# EAGLE design tester (EAGLE 5.06)
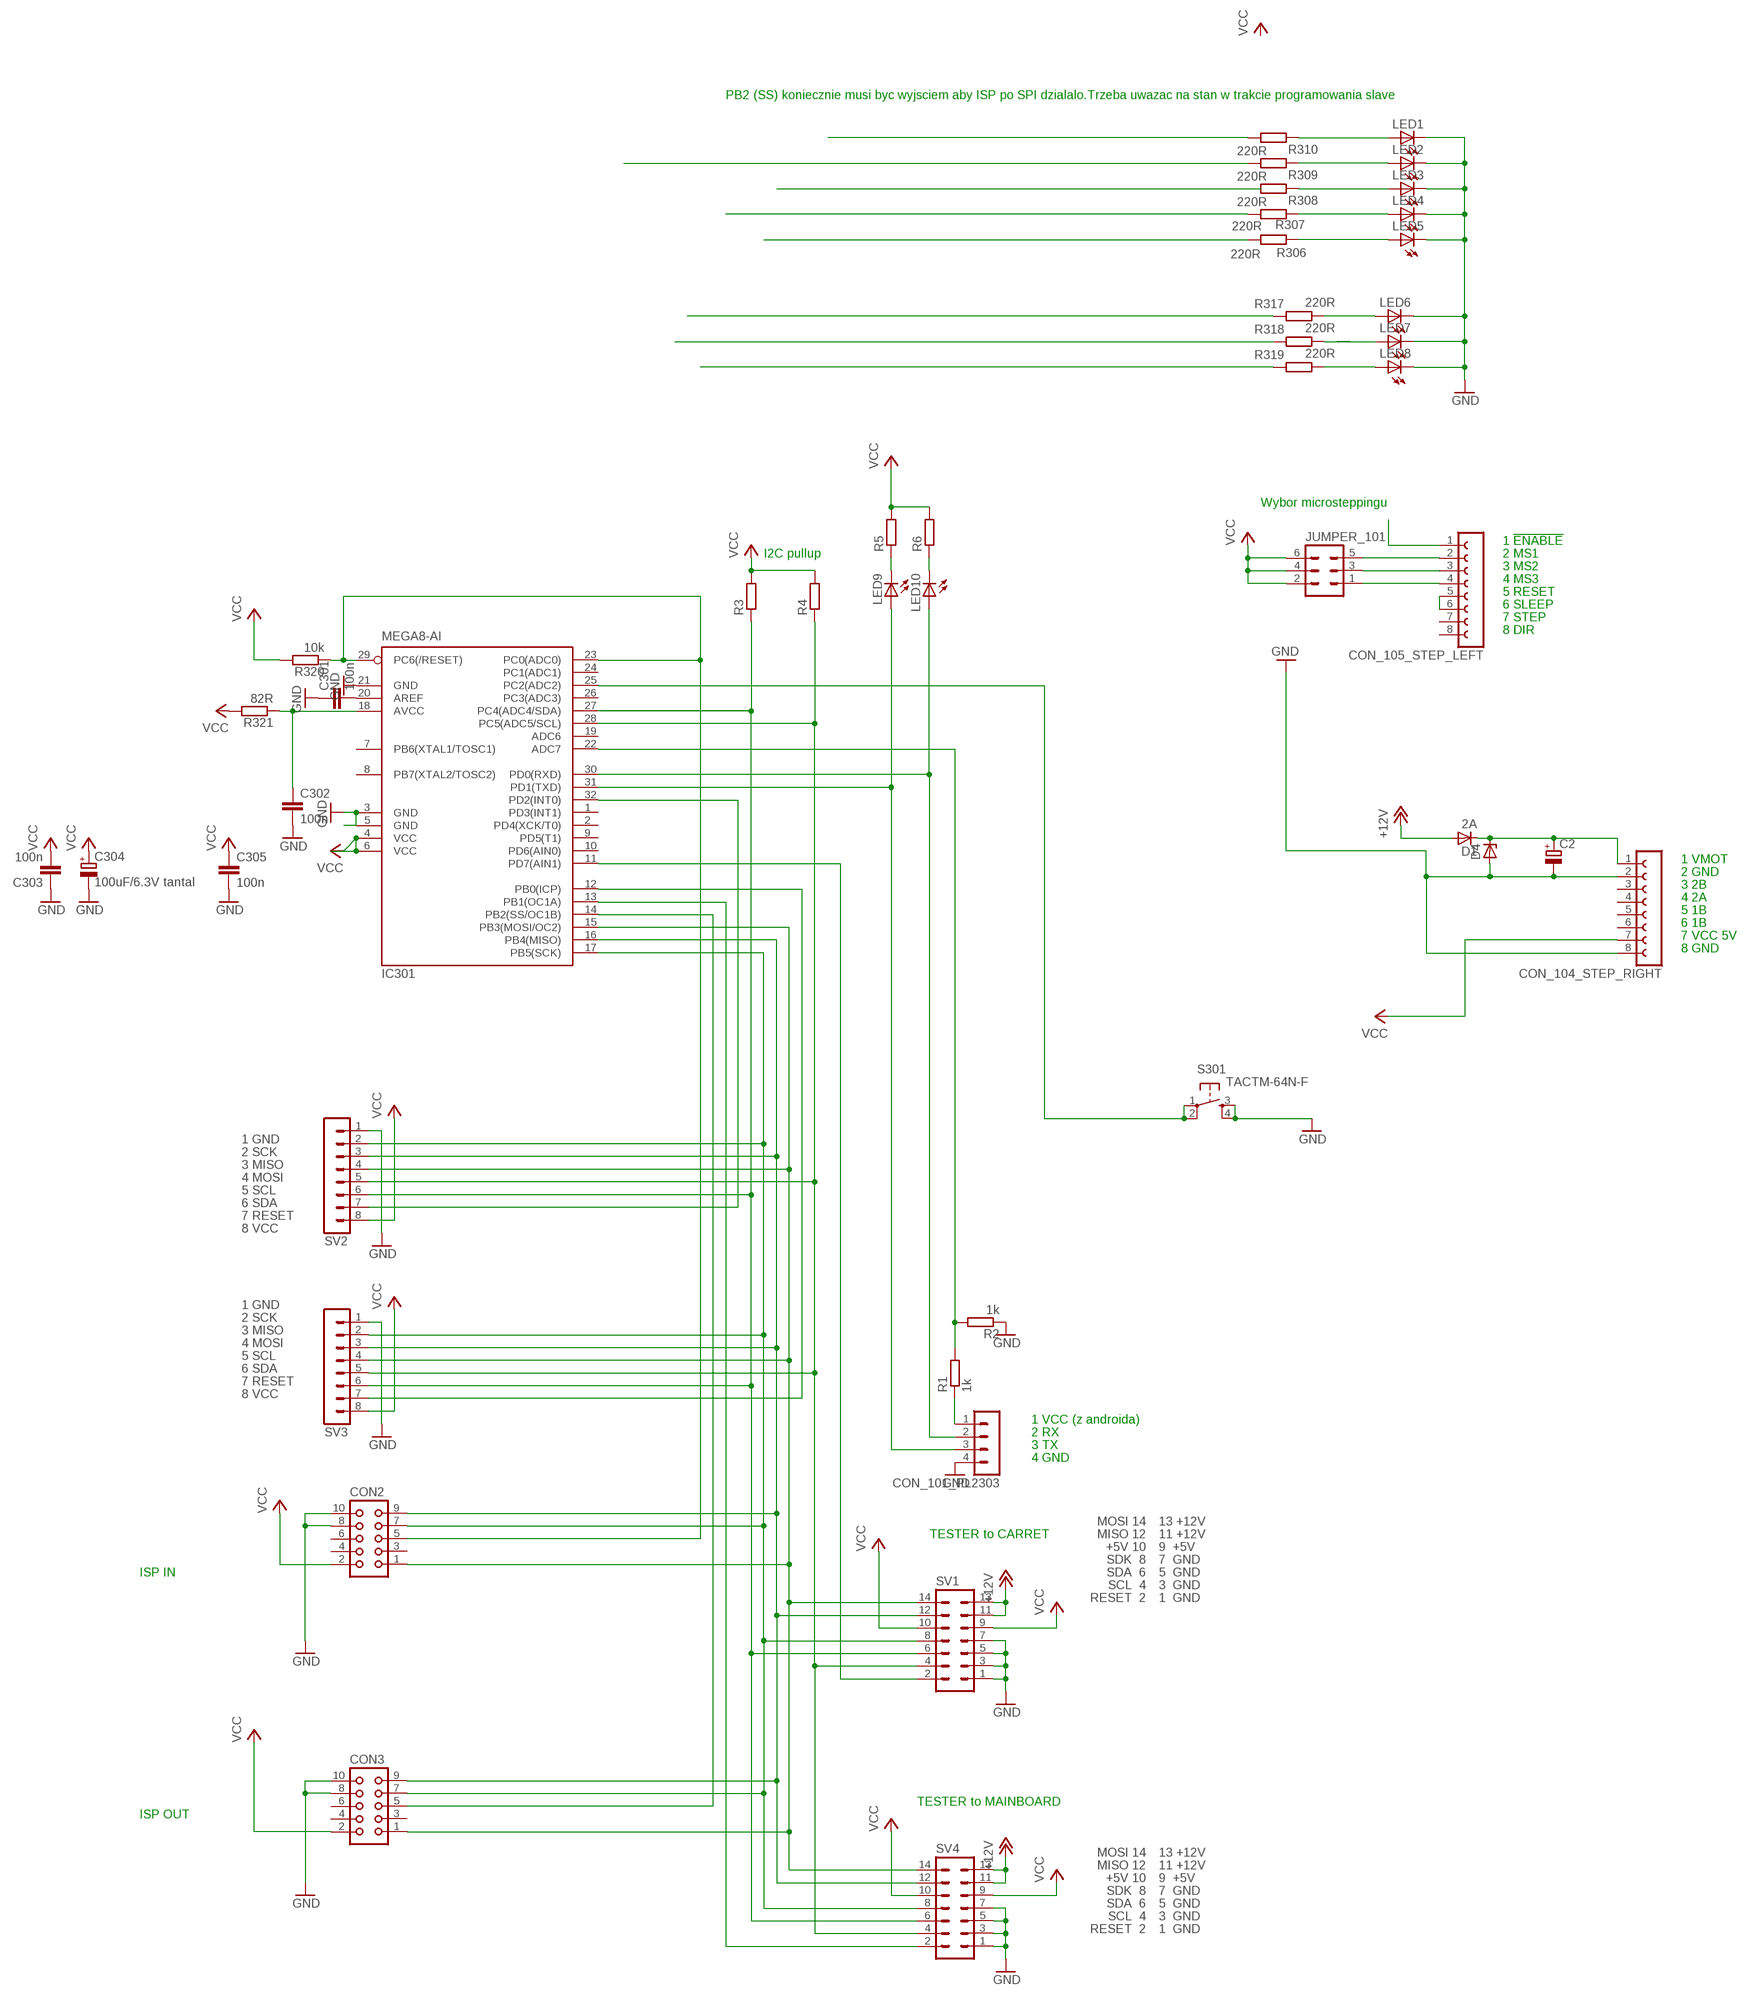
[diagram p0: schematic, sheet 1]

## Parts
C2  CPOL-EUE5-10.5  [E5-10,5]
C301  100n  CAP  [0805]
C302  100n  CAP  [0805]
C303  100n  CAP  [0805]
C304  100uF/6.3V tantal  CPOL-EUSMCB  [SMC_B]
C305  100n  CAP  [0805]
CON2  CON10  [CON10]
CON3  CON10  [CON10]
CON_101_PL2303  MA04-1  [MA04-1]
CON_104_STEP_RIGHT  FE08-1  [FE08]
CON_105_STEP_LEFT  FE08-1  [FE08]
D1  2A  BYS10  [SOD106A]
D4  ZENER-DIODESOD80C  [SOD80C]
IC301  MEGA8-AI  [TQFP32-08]
JUMPER_101  MA03-2  [MA03-2]
LED1  LEDSQR2X5  [LED2X5]
LED2  LEDSQR2X5  [LED2X5]
LED3  LEDSQR2X5  [LED2X5]
LED4  LEDSQR2X5  [LED2X5]
LED5  LEDSQR2X5  [LED2X5]
LED6  LEDSQR2X5  [LED2X5]
LED7  LEDSQR2X5  [LED2X5]
LED8  LEDSQR2X5  [LED2X5]
LED9  LEDSQR2X5  [LED2X5]
LED10  LEDSQR2X5  [LED2X5]
R1  1k  RES0805  [0805]
R2  1k  RES0805  [0805]
R3  RES0805  [0805]
R4  RES0805  [0805]
R5  RES0805  [0805]
R6  RES0805  [0805]
R306  220R  RES0805  [0805]
R307  220R  RES0805  [0805]
R308  220R  RES0805  [0805]
R309  220R  RES0805  [0805]
R310  220R  RES0805  [0805]
R317  220R  R-EU_R0805  [R0805]
R318  220R  R-EU_R0805  [R0805]
R319  220R  R-EU_R0805  [R0805]
R320  10k  RES0805  [0805]
R321  82R  RES0805  [0805]
S301  TACTM-64N-F  DTSM-6  [DTSM-6]
SV1  ML14  [ML14]
SV2  MA08-1  [MA08-1]
SV3  MA08-1  [MA08-1]
SV4  ML14  [ML14]

## Nets
+12V: D1.A SV1.11 SV1.13 SV4.11 SV4.13
CARRET_RESET: SV1.2
GND: C2.- C301.1 C302.2 C303.1 C304.- C305.2 CON2.8 CON2.10 CON3.8 CON3.10 CON_101_PL2303.4 CON_104_STEP_RIGHT.2 CON_104_STEP_RIGHT.8 D4.A IC301.3(GND) IC301.5(GND) IC301.21(GND) LED1.K(C) LED2.K(C) LED3.K(C) LED4.K(C) LED5.K(C) LED6.K(C) LED7.K(C) LED8.K(C) R2.1 S301.3 S301.4 SV1.1 SV1.3 SV1.5 SV1.7 SV2.1 SV3.1 SV4.1 SV4.3 SV4.5 SV4.7
MISO1: CON2.9 CON3.9 IC301.16(PB4(MISO)) SV1.12 SV2.3 SV3.3 SV4.12
MOSI2: CON2.1 CON3.1 IC301.15(PB3(MOSI/OC2)) SV1.14 SV2.4 SV3.4 SV4.14
N$1: LED5.A R306.1
N$2: LED3.A R308.1
N$3: CON_101_PL2303.2 IC301.30(PD0(RXD)) LED10.A
N$4: LED1.A R310.1
N$5: CON_101_PL2303.3 IC301.31(PD1(TXD)) LED9.A
N$6: LED8.A R319.2
N$7: LED7.A R318.2
N$8: LED6.A R317.2
N$9: R317.1
N$10: CON_105_STEP_LEFT.1
N$12: R309.2
N$14: R307.2
N$15: LED4.A R307.1
N$16: LED2.A R309.1
N$17: R319.1
N$18: R306.2
N$19: IC301.25(PC2(ADC2)) S301.1 S301.2
N$20: R318.1
N$21: R310.2
N$22: IC301.11(PD7(AIN1))
N$23: LED9.K(C) R5.1
N$24: IC301.13(PB1(OC1A)) SV4.2
N$26: LED10.K(C) R6.1
N$27: CON3.5 IC301.14(PB2(SS/OC1B))
N$32: C301.2 IC301.20(AREF)
N$33: C302.1 IC301.18(AVCC) R321.1
N$44: CON_105_STEP_LEFT.5 CON_105_STEP_LEFT.6
N$47: IC301.12(PB0(ICP)) SV3.7
N$48: IC301.22(ADC7) R1.2 R2.2
N$49: IC301.32(PD2(INT0)) SV2.7
N$50: CON_105_STEP_LEFT.2 JUMPER_101.5
N$51: CON_105_STEP_LEFT.3 JUMPER_101.3
N$52: CON_105_STEP_LEFT.4 JUMPER_101.1
N$54: CON2.5 IC301.23(PC0(ADC0)) IC301.29(PC6(/RESET)) R320.1
N$55: CON_101_PL2303.1 R1.1
N$56: C2.+ CON_104_STEP_RIGHT.1 D1.K D4.C
SCK1: CON2.7 CON3.7 IC301.17(PB5(SCK)) SV1.8 SV2.2 SV3.2 SV4.8
SCL1: IC301.28(PC5(ADC5/SCL)) R4.1 SV1.4 SV2.5 SV3.5 SV4.4
SDA1: IC301.27(PC4(ADC4/SDA)) R3.1 SV1.6 SV2.6 SV3.6 SV4.6
VCC: C303.2 C304.+ C305.1 CON2.2 CON3.2 CON_104_STEP_RIGHT.7 IC301.4(VCC) IC301.6(VCC) JUMPER_101.2 JUMPER_101.4 JUMPER_101.6 R3.2 R4.2 R5.2 R6.2 R320.2 R321.2 SV1.9 SV1.10 SV2.8 SV3.8 SV4.9 SV4.10
Unconnected: CON2.3 CON2.4 CON2.6 CON3.3 CON3.4 CON3.6 CON_104_STEP_RIGHT.3 CON_104_STEP_RIGHT.4 CON_104_STEP_RIGHT.5 CON_104_STEP_RIGHT.6 CON_105_STEP_LEFT.7 CON_105_STEP_LEFT.8 IC301.1(PD3(INT1)) IC301.2(PD4(XCK/T0)) IC301.7(PB6(XTAL1/TOSC1)) IC301.8(PB7(XTAL2/TOSC2)) IC301.9(PD5(T1)) IC301.10(PD6(AIN0)) IC301.19(ADC6) IC301.24(PC1(ADC1)) IC301.26(PC3(ADC3)) R308.2

## Notes on the sheet
- PB2 (SS) koniecznie musi byc wyjsciem aby ISP po SPI dzialalo.Trzeba uwazac na stan w trakcie programowania slave
- Wybor microsteppingu
- 1 !ENABLE
- I2C pullup | 2 MS1
- 3 MS2
- 4 MS3
- 5 RESET
- 6 SLEEP
- 7 STEP
- 8 DIR
- 1 VMOT
- 2 GND
- 3 2B
- 4 2A
- 5 1B
- 6 1B
- 7 VCC 5V
- 8 GND
- 1 GND
- 2 SCK
- 3 MISO
- 4 MOSI
- 5 SCL
- 6 SDA
- 7 RESET
- 8 VCC
- 1 GND
- 2 SCK
- 3 MISO
- 4 MOSI
- 5 SCL
- 6 SDA
- 7 RESET
- 8 VCC
- 1 VCC (z androida)
- 2 RX
- 3 TX
- 4 GND
- MOSI 14 | 13 +12V
- TESTER to CARRET | MISO 12 | 11 +12V
- +5V 10 | 9  +5V
- SDK  8 | 7  GND
- ISP IN | SDA  6 | 5  GND
- SCL  4 | 3  GND
- RESET  2 | 1  GND
- TESTER to MAINBOARD
- ISP OUT
- MOSI 14 | 13 +12V
- MISO 12 | 11 +12V
- +5V 10 | 9  +5V
- SDK  8 | 7  GND
- SDA  6 | 5  GND
- SCL  4 | 3  GND
- RESET  2 | 1  GND

## Library data of the parts
C2 C304 = rcl:CPOL-EU: POLARIZED CAPACITOR, European symbol
C301-C303 C305 = barobot:CAP
CON2 CON3 = con-harting:CON10: CONNECTOR
CON_101_PL2303 = con-lstb:MA04-1: PIN HEADER
CON_104_STEP_RIGHT CON_105_STEP_LEFT = con-lsta:FE08-1: FEMALE HEADER
D1 = telefunken:BYS10: DIODE
D4 = diode:ZENER-DIODE: Z-Diode
IC301 = atmel:MEGA8: MICROCONTROLLER 8 Kbytes FLASH, 1 kbytes SRAM, 512 bytes EEPROM, USART, 6-channel 10 bit ADC, 2-channel 8 bit ADC Pin compatible with Atmega48, ATMega88, ATMega168 Source: avr.lbr
JUMPER_101 = con-lstb:MA03-2: PIN HEADER
LED1-LED10 = led:LED: LED OSRAM: - CHIPLED LG R971, LG N971, LY N971, LG Q971, LY Q971, LO R971, LY R971 LH N974, LH R974 LS Q976, LO Q976, LY Q976 LO Q996 - Hyper CHIPLED LW Q18S LB Q993, LB Q99A, LB R99A - SideLED LS A670, LO A670, LY A670, LG A670, LP A670 LB A673, LV A673, LT A673, LW A673 LH A674 LY A675 LS A676, LA A676, LO A676, LY A676, LW A676 LS A679, LY A679, LG A679 - Hyper Micro SIDELED® LS Y876, LA Y876, LO Y876, LY Y876 LT Y87S - SmartLED LW L88C, LW L88S LB L89C, LB L89S, LG L890 LS L89K, LO L89K, LY L89K LS L896, LA L896, LO L896, LY L896 - TOPLED LS T670, LO T670, LY T670, LG T670, LP T670 LSG T670, LSP T670, LSY T670, LOP T670, LYG T670 LG T671, LOG T671, LSG T671 LB T673, LV T673, LT T673, LW T673 LH T674 LS T676, LA T676, LO T676, LY T676, LB T676, LH T676, LSB T676, LW T676 LB T67C, LV T67C, LT T67C, LS T67K, LO T67K, LY T67K, LW E67C LS E67B, LA E67B, LO E67B, LY E67B, LB E67C, LV E67C, LT E67C LW T67C LS T679, LY T679, LG T679 LS T770, LO T770, LY T770, LG T770, LP T770 LB T773, LV T773, LT T773, LW T773 LH T774 LS E675, LA E675, LY E675, LS T675 LS T776, LA T776, LO T776, LY T776, LB T776 LHGB T686 LT T68C, LB T68C - Hyper Mini TOPLED® LB M676 - Mini TOPLED Santana® LG M470 LS M47K, LO M47K, LY M47K Source: http://www.osram.convergy.de LUXEON: - LUMILED® LXK2-PW12-R00, LXK2-PW12-S00, LXK2-PW14-U00, LXK2-PW14-V00 LXK2-PM12-R00, LXK2-PM12-S00, LXK2-PM14-U00 LXK2-PE12-Q00, LXK2-PE12-R00, LXK2-PE12-S00, LXK2-PE14-T00, LXK2-PE14-U00 LXK2-PB12-K00, LXK2-PB12-L00, LXK2-PB12-M00, LXK2-PB14-N00, LXK2-PB14-P00, LXK2-PB14-Q00 LXK2-PR12-L00, LXK2-PR12-M00, LXK2-PR14-Q00, LXK2-PR14-R00 LXK2-PD12-Q00, LXK2-PD12-R00, LXK2-PD12-S00 LXK2-PH12-R00, LXK2-PH12-S00 LXK2-PL12-P00, LXK2-PL12-Q00, LXK2-PL12-R00 Source: www.luxeon.com KINGBRIGHT: KA-3528ASYC Source: www.kingbright.com
R1-R6 R306-R310 R320 R321 = barobot:RES
R317-R319 = resistor:R-EU_: RESISTOR, European symbol
S301 = switch-tact:DTSM-6
SV1 SV4 = con-ml:ML14: HARTING
SV2 SV3 = con-lstb:MA08-1: PIN HEADER

## Board
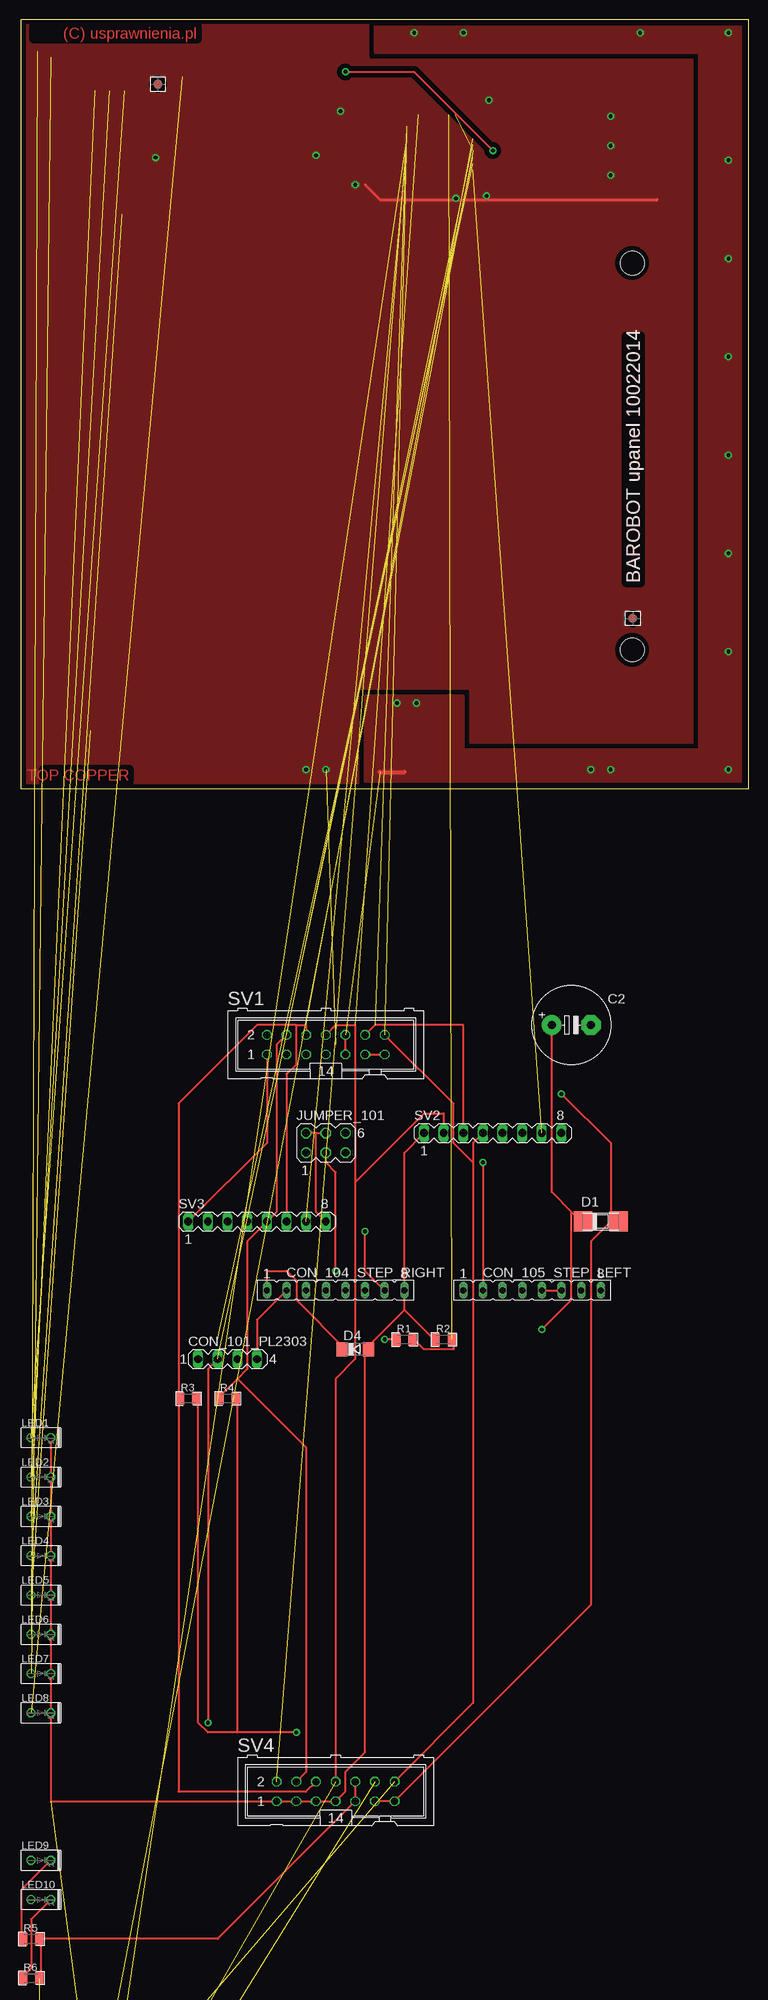
[diagram p1: board, top side]
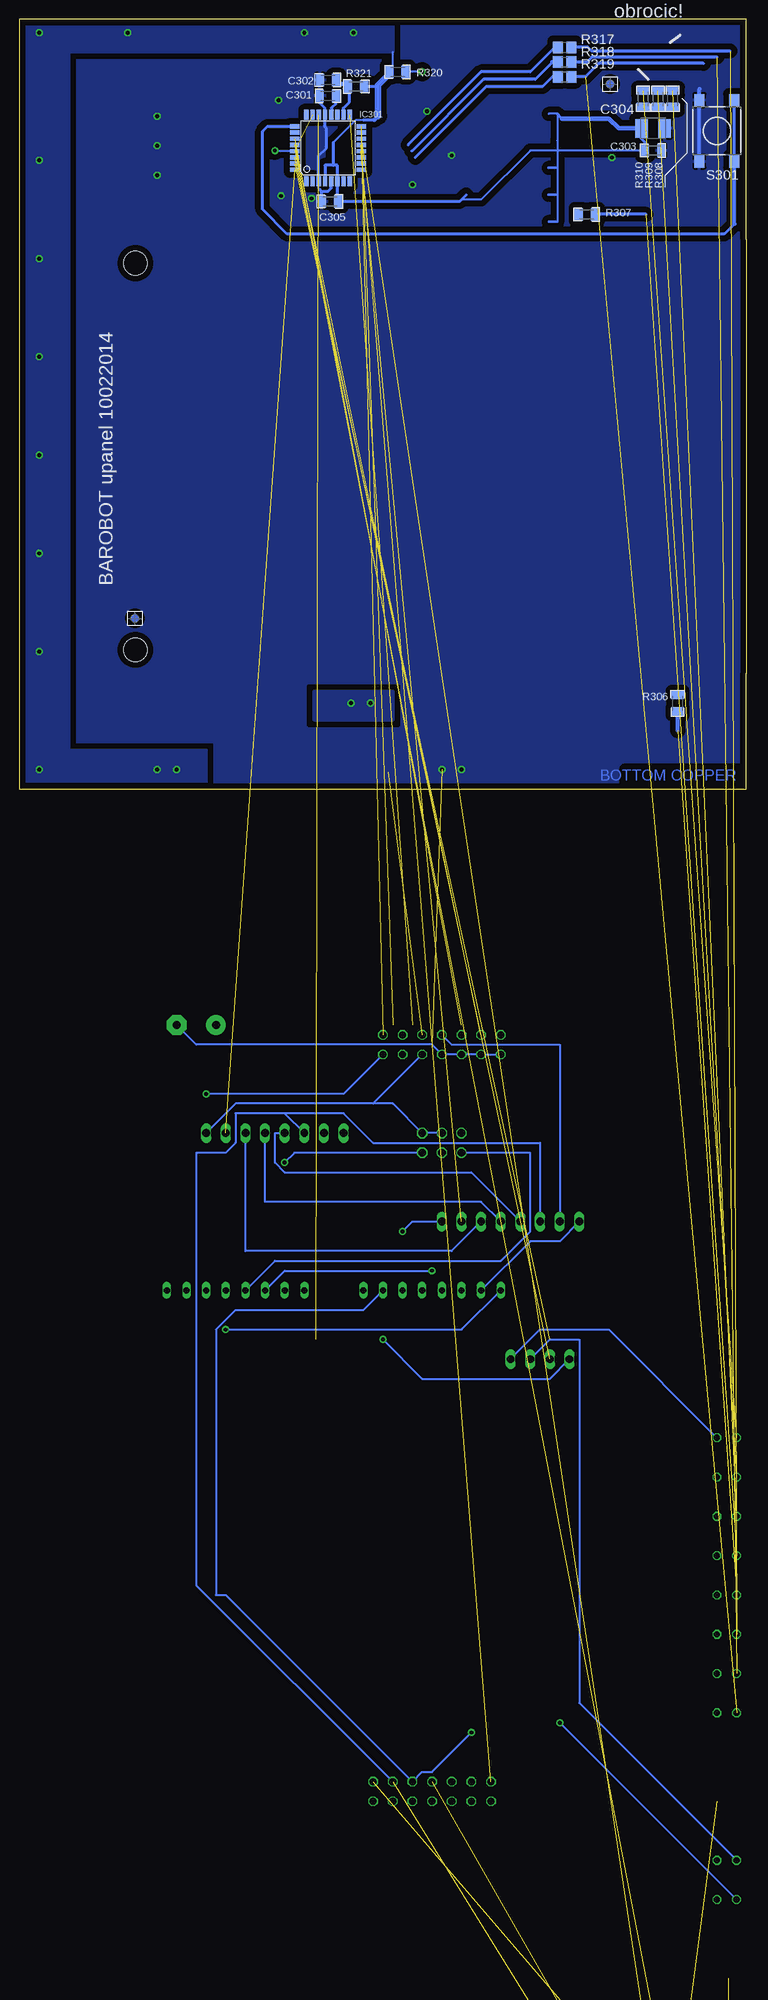
[diagram p2: board, bottom side, seen from below]

Size 94.03 x 99.5 mm. Coordinates in mm from the lower left corner, seen from the top.
Outline: 0.03,99.5 94.03,99.5 94.03,0 0.03,0 0.03,15 0,15 0,71 0.03,71 0.03,99.5
Copper layers (1*16): Top 0.035mm / dielectric 1.5mm / Bottom 0.035mm
Design rules "default *": minimum track width 10mil, minimum drill 0.5mm, track to track 10mil, track to pad 10mil, pad to pad 8mil, via to via 8mil, smd to smd 8mil, copper to edge 20mil, drill to drill 8mil, minimum pad ring 6mil, minimum via ring 8mil, stop-mask expansion 2mil, vias tented up to drill 0mil, thermal gap 10mil
Holes 3.1 mm at 79.03,18 79.03,68
bRestrict: area 11.8,84.1 to 12.4,87

### Footprints (pad centres in the part's own frame; a part is rotated, then mirrored left to right if it is on the bottom)
E5-10,5 = drill 1.016 pad 2.54 round: + -2.54,0 | drill 1.016 pad 2.54 octagon: - 2.54,0
0805 = smd 1.044 x 1.6: 1 -1.048,0; 2 1.048,0
SMC_B = smd 1.6 x 2.4: + -1.5,0; - 1.5,0
CON10 = drill 0.914 round: 1 -5.08,-1.27 | drill 0.914 octagon: 2 -5.08,1.27; 3 -2.54,-1.27; 4 -2.54,1.27; 5 0,-1.27; 6 0,1.27; 7 2.54,-1.27; 8 2.54,1.27; 9 5.08,-1.27; 10 5.08,1.27
MA04-1 = drill 1.016 long: 1 -3.81,0; 2 -1.27,0; 3 1.27,0; 4 3.81,0
FE08 = drill 0.813 long: 1 -8.89,0; 2 -6.35,0; 3 -3.81,0; 4 -1.27,0; 5 1.27,0; 6 3.81,0; 7 6.35,0; 8 8.89,0
SOD106A = smd 2.4 x 2.6: A 2.3,0; K -2.3,0
SOD80C = smd 1.4 x 1.8: A 1.7,0; C -1.7,0
TQFP32-08 = smd 1.27 x 0.559: 1 -4.293,2.8; 2 -4.293,2; 3 -4.293,1.2; 4 -4.293,0.4; 5 -4.293,-0.4; 6 -4.293,-1.2; 7 -4.293,-2; 8 -4.293,-2.8; 17 4.293,-2.8; 18 4.293,-2; 19 4.293,-1.2; 20 4.293,-0.4; 21 4.293,0.4; 22 4.293,1.2; 23 4.293,2; 24 4.293,2.8 | smd 0.559 x 1.27: 9 -2.8,-4.293; 10 -2,-4.293; 11 -1.2,-4.293; 12 -0.4,-4.293; 13 0.4,-4.293; 14 1.2,-4.293; 15 2,-4.293; 16 2.8,-4.293; 25 2.8,4.293; 26 2,4.293; 27 1.2,4.293; 28 0.4,4.293; 29 -0.4,4.293; 30 -1.2,4.293; 31 -2,4.293; 32 -2.8,4.293
MA03-2 = drill 1.016 round: 1 -2.54,-1.27 | drill 1.016 octagon: 2 -2.54,1.27; 3 0,-1.27; 4 0,1.27; 5 2.54,-1.27; 6 2.54,1.27
LED2X5 = drill 0.813 octagon: A -1.27,0; K 1.27,0
R0805 = smd 1.3 x 1.5: 1 -0.85,0; 2 0.85,0
DTSM-6 = smd 1.55 x 1.3: 1 -3.975,2.25; 2 3.975,2.25; 3 -3.975,-2.25; 4 3.975,-2.25
ML14 = drill 0.914 octagon: 1 -7.62,-1.27; 2 -7.62,1.27; 3 -5.08,-1.27; 4 -5.08,1.27; 5 -2.54,-1.27; 6 -2.54,1.27; 7 0,-1.27; 8 0,1.27; 9 2.54,-1.27; 10 2.54,1.27; 11 5.08,-1.27; 12 5.08,1.27; 13 7.62,-1.27; 14 7.62,1.27
MA08-1 = drill 1.016 long: 1 -8.89,0; 2 -6.35,0; 3 -3.81,0; 4 -1.27,0; 5 1.27,0; 6 3.81,0; 7 6.35,0; 8 8.89,0

### Placement (x,y rotation side)
C2  71.15,-30.48 0 top  (outside the outline)
C301  54.14,89.6 0 bottom
C302  54.11,91.66 180 bottom
C303  12.09,82.55 180 bottom
C304  12.09,85.41 0 bottom
C305  53.85,75.95 180 bottom
CON2  7.65,-180.34 0 top  (outside the outline)
CON3  7.65,-195.58 0 top  (outside the outline)
CON_101_PL2303  26.7,-73.66 0 top  (outside the outline)
CON_104_STEP_RIGHT  40.67,-64.77 0 top  (outside the outline)
CON_105_STEP_LEFT  66.07,-64.77 0 top  (outside the outline)
D1  74.96,-55.88 0 top  (outside the outline)
D4  43.21,-72.39 0 top  (outside the outline)
IC301  54.11,82.87 90 bottom
JUMPER_101  39.4,-45.72 0 top  (outside the outline)
LED1  2.57,-83.82 0 top  (outside the outline)
LED2  2.57,-88.9 0 top  (outside the outline)
LED3  2.57,-93.98 0 top  (outside the outline)
LED4  2.57,-99.06 0 top  (outside the outline)
LED5  2.57,-104.14 0 top  (outside the outline)
LED6  2.57,-109.22 0 top  (outside the outline)
LED7  2.57,-114.3 0 top  (outside the outline)
LED8  2.57,-119.38 0 top  (outside the outline)
LED9  2.57,-138.43 0 top  (outside the outline)
LED10  2.57,-143.51 0 top  (outside the outline)
R1  49.56,-71.12 0 top  (outside the outline)
R2  54.64,-71.12 0 top  (outside the outline)
R3  21.62,-78.74 0 top  (outside the outline)
R4  26.7,-78.74 0 top  (outside the outline)
R5  1.3,-148.59 0 top  (outside the outline)
R6  1.3,-153.67 0 top  (outside the outline)
R306  8.92,11.11 90 bottom
R307  20.67,74.3 180 bottom
R308  9.55,89.22 270 bottom
R309  11.46,89.22 270 bottom
R310  13.36,89.22 270 bottom
R317  23.52,95.89 0 bottom
R318  23.52,93.98 0 bottom
R319  23.52,92.08 0 bottom
R320  45.11,92.71 180 bottom
R321  50.51,90.81 0 bottom
S301  3.84,85.09 270 bottom
SV1  39.4,-33.02 0 top  (outside the outline)
SV2  60.99,-44.45 0 top  (outside the outline)
SV3  30.51,-55.88 0 top  (outside the outline)
SV4  40.67,-129.54 0 top  (outside the outline)
U$1  [FIDUCIAL_G10S]  17.69,91.11 0 top
U$2  [FIDUCIAL_G10S]  17.65,91.12 0 bottom
U$3  [FIDUCIAL_G10S]  79.09,22.07 0 bottom
U$4  [FIDUCIAL_G10S]  79.09,22.07 0 top

### Tracks (layer width: path | path; a pad name or v marks a point on that pad's centre or on a via)
+12V  (via drill 0.5)
  Top 0.254: SV1.11 SV1.13 | SV4.11 SV4.13 73.69,-105.41 73.69,-58.42 76.23,-55.88 | v69.88,-39.37 76.23,-45.72 76.23,-55.88 | 76.23,-55.88 D1.A
  Bottom 0.254: SV1.13 52.1,-39.37 v69.88,-39.37
GND  (via drill 0.5)  (5 unrouted)
  Top 0.254: CON_104_STEP_RIGHT.2 30.51,-68.58 CON_101_PL2303.4 | SV3.1 31.78,-45.72 SV1.1 | 49.56,-67.31 53.37,-71.12 R2.1 | 49.56,-67.31 CON_104_STEP_RIGHT.8 49.56,-46.99 SV2.1 | 44.48,-72.39 49.56,-67.31 | LED1.K LED2.K LED3.K LED4.K LED5.K LED6.K LED7.K LED8.K 3.84,-130.81 SV4.1 SV4.3 SV4.5 SV4.7 41.94,-129.54 41.94,-127 44.48,-124.46 44.48,-72.39 | 44.48,-72.39 D4.A
  Top 0.406: 82.26,76.2 46.38,76.2 44.48,78.11
  Bottom 0.254: IC301.3 55.31,77.6 55.24,77.52 | SV1.1 SV1.3 SV1.5 SV1.7 40.67,-33.02 71.15,-33.02 C2.- | CON_104_STEP_RIGHT.2 27.97,-58.42 24.16,-58.42 SV3.1 | CON_101_PL2303.4 26.7,-69.85 17.81,-69.85 LED1.K
  Bottom 0.406: IC301.5 53.71,77.69 54.11,77.29 54.96,77.29 | 54.96,77.29 55.01,77.29 55.24,77.52 | 55.24,89.48 55.24,88.74 54.51,88.02 IC301.21 54.51,85.6 54.32,85.41 54.32,82.87 55.31,81.88 IC301.3 | C305.2 54.96,76.01 54.96,77.29
  Bottom 0.508: S301.4 S301.3 6.09,90.49 | C302.2 55.15,91.67 55.13,91.68 55.11,91.68 55.14,91.66 55.14,91.64 55.04,91.74 55.03,91.74
  other vias: 38.13,81.92 56.23,76.36 43.21,78.11 76.23,79.38 76.23,83.19 76.23,87 60.51,89.06 41.3,87.63 60.2,76.68 39.4,2.54 36.86,2.54 17.41,81.64
  pour Bottom (isolate 0.762, rank 3): -1.24,101.6 99.09,101.6 99.09,-2.54 -1.24,-2.54
  pour Top (isolate 0.61, rank 2): 0.03,99.06 96.55,99.06 96.55,-1.27 0.03,-1.27
MISO1  (3 unrouted)
  Top 0.254: SV1.12 45.75,-30.48 57.18,-30.48 SV2.3
  Bottom 0.254: SV4.12 71.15,-102.87 71.15,-46.99 67.34,-46.99 66.07,-45.72 66.07,-41.91 59.72,-41.91 | 59.72,-41.91 SV2.3 | SV3.3 26.7,-45.72 48.29,-45.72 52.1,-41.91 59.72,-41.91
MOSI2  (3 unrouted)
  Top 0.254: SV4.14 58.45,-118.11 58.45,-48.26 | 58.45,-48.26 58.45,-45.72 SV2.4 | SV1.14 55.91,-40.64 55.91,-45.72 58.45,-48.26
  Bottom 0.254: SV3.4 35.59,-49.53 59.72,-49.53 60.99,-48.26 60.99,-44.45 SV2.4
N$1  (1 unrouted)
  Bottom 0.508: 8.92,7.61 R306.1
N$2  (1 unrouted)
  Bottom 0.406: R308.1 9.73,90.27
N$3  (via drill 0.5)  (1 unrouted)
  Top 0.254: v24.16,-120.65 24.16,-74.93 CON_101_PL2303.2
  Bottom 0.254: v24.16,-120.65 LED10.A
N$4  (1 unrouted)
  Bottom 0.406: R310.1 13.19,90.27
N$5  (1 unrouted)
  Bottom 0.254: LED9.A 21.62,-118.11 21.62,-71.12 25.43,-71.12 CON_101_PL2303.3
N$6  (1 unrouted)
  Bottom 0.406: 5.57,93.82 19.08,93.82 20.83,92.08 R319.2
N$7  (1 unrouted)
  Bottom 0.406: 3.84,94.62 20.03,94.62 20.67,93.98 R318.2
N$8  (1 unrouted)
  Bottom 0.406: 2.11,95.41 20.03,95.41 20.51,95.89 R317.2
N$9
  Bottom 0.406: 43.76,83.27 34.32,92.71 27.97,92.71 24.79,95.89 R317.1
N$15  (1 unrouted)
  Bottom 0.406: 13.01,74.3 R307.1
N$16  (1 unrouted)
N$17
  Bottom 0.406: R319.1 25.11,92.08 26.38,90.81 33.68,90.81 42.82,81.67
N$19
  Bottom 0.406: 1.59,73.05 2.89,71.76 59.4,71.76 62.58,74.93 62.58,85.03 61.94,85.67 IC301.25 | S301.2 S301.1
  Bottom 0.508: 1.59,73.05 S301.2
N$20
  Bottom 0.406: 25.11,93.98 27.33,91.76 34,91.76 43.29,82.47
  Bottom 0.508: R318.1 25.11,93.98
N$23
  Top 0.254: LED9.K 0.03,-142.24 0.03,-148.59 R5.1
N$24  (1 unrouted)
N$26
  Top 0.254: LED10.K 1.3,-146.05 1.3,-152.4 0.03,-153.67 R6.1
N$27  (1 unrouted)
N$32
  Bottom 0.406: IC301.20 53.66,87.21 53.66,88.07 53.11,88.62 53.11,89.6 C301.2
  Bottom 0.508: C301.2 53.11,89.6
N$33
  Bottom 0.406: IC301.18 52.11,88.04 51.36,88.79 51.36,90.71
  Bottom 0.508: C302.1 | C302.1 53.05,91.66 53.05,91.12 51.56,91.12 R321.1 51.56,90.71 51.36,90.71
N$44
  Top 0.254: CON_105_STEP_LEFT.5 CON_105_STEP_LEFT.6
N$47  (1 unrouted)
N$48  (1 unrouted)
  Top 0.254: R1.2 50.83,-71.12 52.1,-72.39 55.91,-72.39 55.91,-71.12 R2.2
N$49  (1 unrouted)
N$50  (via drill 0.5)
  Top 0.254: v59.72,-48.26 CON_105_STEP_LEFT.2
  Bottom 0.254: v59.72,-48.26 58.45,-46.99 JUMPER_101.5
N$51  (via drill 0.5)
  Top 0.254: v40.67,-62.23 40.67,-49.53 39.4,-48.26 JUMPER_101.3
  Bottom 0.254: CON_105_STEP_LEFT.3 59.72,-62.23 v40.67,-62.23
N$52
  Bottom 0.254: CON_105_STEP_LEFT.4 60.99,-60.96 31.78,-60.96 27.97,-57.15 27.97,-46.99 JUMPER_101.1
N$54  (via drill 0.5)  (2 unrouted)
  Top 0.254: v60.99,82.55 50.83,92.71 v41.94,92.71
  Bottom 0.254: v60.99,82.55 58.45,82.55 IC301.29 | v41.94,92.71 R320.1 44.48,92.71
N$55  (via drill 0.5)
  Top 0.254: R1.1 v47.02,-71.12
  Bottom 0.254: v47.02,-71.12 41.94,-76.2 25.43,-76.2 CON_101_PL2303.1
N$56  (via drill 0.5)
  Top 0.254: CON_104_STEP_RIGHT.1 31.78,-62.23 34.32,-62.23 35.59,-63.5 35.59,-66.04 41.94,-72.39 D4.C | 71.15,-54.61 68.61,-52.07 C2.+ | 71.15,-54.61 72.42,-55.88 D1.K | v67.34,-69.85 71.15,-66.04 71.15,-54.61
  Bottom 0.254: CON_104_STEP_RIGHT.1 36.86,-69.85 v67.34,-69.85
SCK1  (3 unrouted)
  Top 0.254: SV4.8 40.67,-76.2 43.21,-73.66 43.21,-50.8 | 43.21,-50.8 52.1,-41.91 54.64,-41.91 SV2.2 | SV1.8 40.67,-30.48 43.21,-30.48 43.21,-50.8
  Bottom 0.254: SV3.2 24.16,-33.02 38.13,-33.02 SV1.8
SCL1  (1 unrouted)
  Top 0.254: 27.97,-76.2 29.24,-74.93 29.24,-58.42 SV3.5 33.05,-54.61 33.05,-33.02 SV1.4 | 27.97,-76.2 25.43,-78.74 R4.1 | SV4.4 36.86,-127 36.86,-85.09 27.97,-76.2
  Bottom 0.254: SV2.5 62.26,-53.34 34.32,-53.34 SV3.5
SDA1  (1 unrouted)
  Top 0.254: 20.35,-78.74 20.35,-40.64 30.51,-30.48 35.59,-30.48 | 35.59,-30.48 36.86,-30.48 SV1.6 | SV4.6 36.86,-129.54 20.35,-129.54 20.35,-78.74 | 20.35,-78.74 R3.1 | SV3.6 34.32,-36.83 35.59,-35.56 35.59,-30.48
  Bottom 0.254: SV2.6 64.8,-59.69 38.13,-59.69 SV3.6
VCC  (via drill 0.5)  (3 unrouted)
  Top 0.254: CON_104_STEP_RIGHT.7 44.48,-62.23 v44.48,-57.15 | SV1.9 SV1.10 | 38.13,-44.45 JUMPER_101.4 | 38.13,-44.45 JUMPER_101.2 | SV3.8 38.13,-54.61 38.13,-44.45 | 27.97,-121.92 24.16,-121.92 22.89,-120.65 22.89,-78.74 R3.2 | 27.97,-121.92 27.97,-78.74 R4.2 | SV4.10 SV4.9 25.43,-148.59 2.57,-148.59 | 2.57,-148.59 2.57,-153.67 R6.2 | 2.57,-148.59 R5.2 | v35.59,-121.92 27.97,-121.92
  Top 0.508: 46.38,2.22 49.56,2.22
  Bottom 0.254: 25.6,87.29 24.48,87.29 24.48,83.82 | 24.48,76.84 24.48,73.34 | 24.48,80.33 24.48,76.84 | 24.48,83.82 24.48,80.33 | 24.48,76.84 24.48,76.81 | 24.48,80.33 24.48,80.3 | 24.48,83.82 | 53.42,83.61 50.51,86.52 49.56,86.52 | 36.86,76.2 34.32,76.2 27.97,82.55 12.73,82.55 C303.2 | 45.75,95.25 45.75,92.71 R320.2 | v44.48,-57.15 43.21,-55.88 SV3.8 | JUMPER_101.4 JUMPER_101.6 45.75,-40.64 48.29,-40.64 | SV2.8 66.07,-40.64 48.29,-40.64 | 48.29,-40.64 SV1.9 | v35.59,-121.92 40.67,-127 41.94,-127 SV4.10 67.34,-104.14 68.61,-104.14 68.61,-69.85 66.07,-67.31 49.56,-67.31 CON_104_STEP_RIGHT.7
  Bottom 0.305: 24.48,73.34 25.58,73.34 | 24.48,76.81 25.6,76.81 | 24.48,80.3 25.6,80.3
  Bottom 0.406: 53.42,80.65 53.42,83.61 | 46.38,92.28 46.38,92.71 | 46.38,92.71 46.38,92.81 | 49.56,86.52 48.13,86.52 | 47.65,90.81 R321.2 | 14.63,85.39 C304.+ 13.59,84.05 13.09,83.55 13.14,83.5 C303.2 | 23.87,86.68 24.48,87.29 | IC301.4 54.51,80.65 53.42,80.65 | 53.42,80.65 52.91,80.65 IC301.6 52.91,75.95 C305.1 37.11,75.95 36.86,76.2 36.22,76.84 | 46.38,92.71 R320.2
  Bottom 0.508: 48.13,86.52 47.65,87 | C303.2 13.1,82.55 | C305.1 52.85,75.95
  Bottom 0.61: C304.+ 16.54,85.41 17.81,86.68 23.87,86.68
  Bottom 0.813: 46.38,92.28 47.65,91.01 47.65,90.81 47.65,87
  other vias: 57.18,97.79 80.04,97.79 91.47,97.79 91.47,81.28 91.47,68.58 91.47,55.88 91.47,43.18 91.47,30.48 91.47,17.78 91.47,2.54 73.69,2.54 50.83,97.79 48.61,11.11 51.15,11.11 76.23,2.54
  pour Top (isolate 0.813): 44.48,0 94.01,0 94.01,99.06 45.75,99.06 45.75,95.25 87.66,95.25 87.66,5.08 57.18,5.08 57.18,12.07 44.48,12.07
  pour Bottom (isolate 0.813, rank 2): 69.88,0 94.01,0 94.01,99.06 45.75,99.06 45.75,95.25 87.66,95.25 87.66,5.08 69.88,5.08
  pour Bottom (isolate 0.813, rank 2): 55.91,8.89 55.91,12.7 45.75,12.7 45.75,8.89

### Text on the board
Top: (C) usprawnienia.pl | BAROBOT upanel 10022014 | TOP COPPER
Bottom: BOTTOM COPPER
tNames: BAROBOT upanel 10022014
bNames: obrocic! | BAROBOT upanel 10022014
bDocu: GND | SCK | MIS | MOSI | SCL | SDA | RESET | VCC